# Altium project codenic-clock.PrjPcb
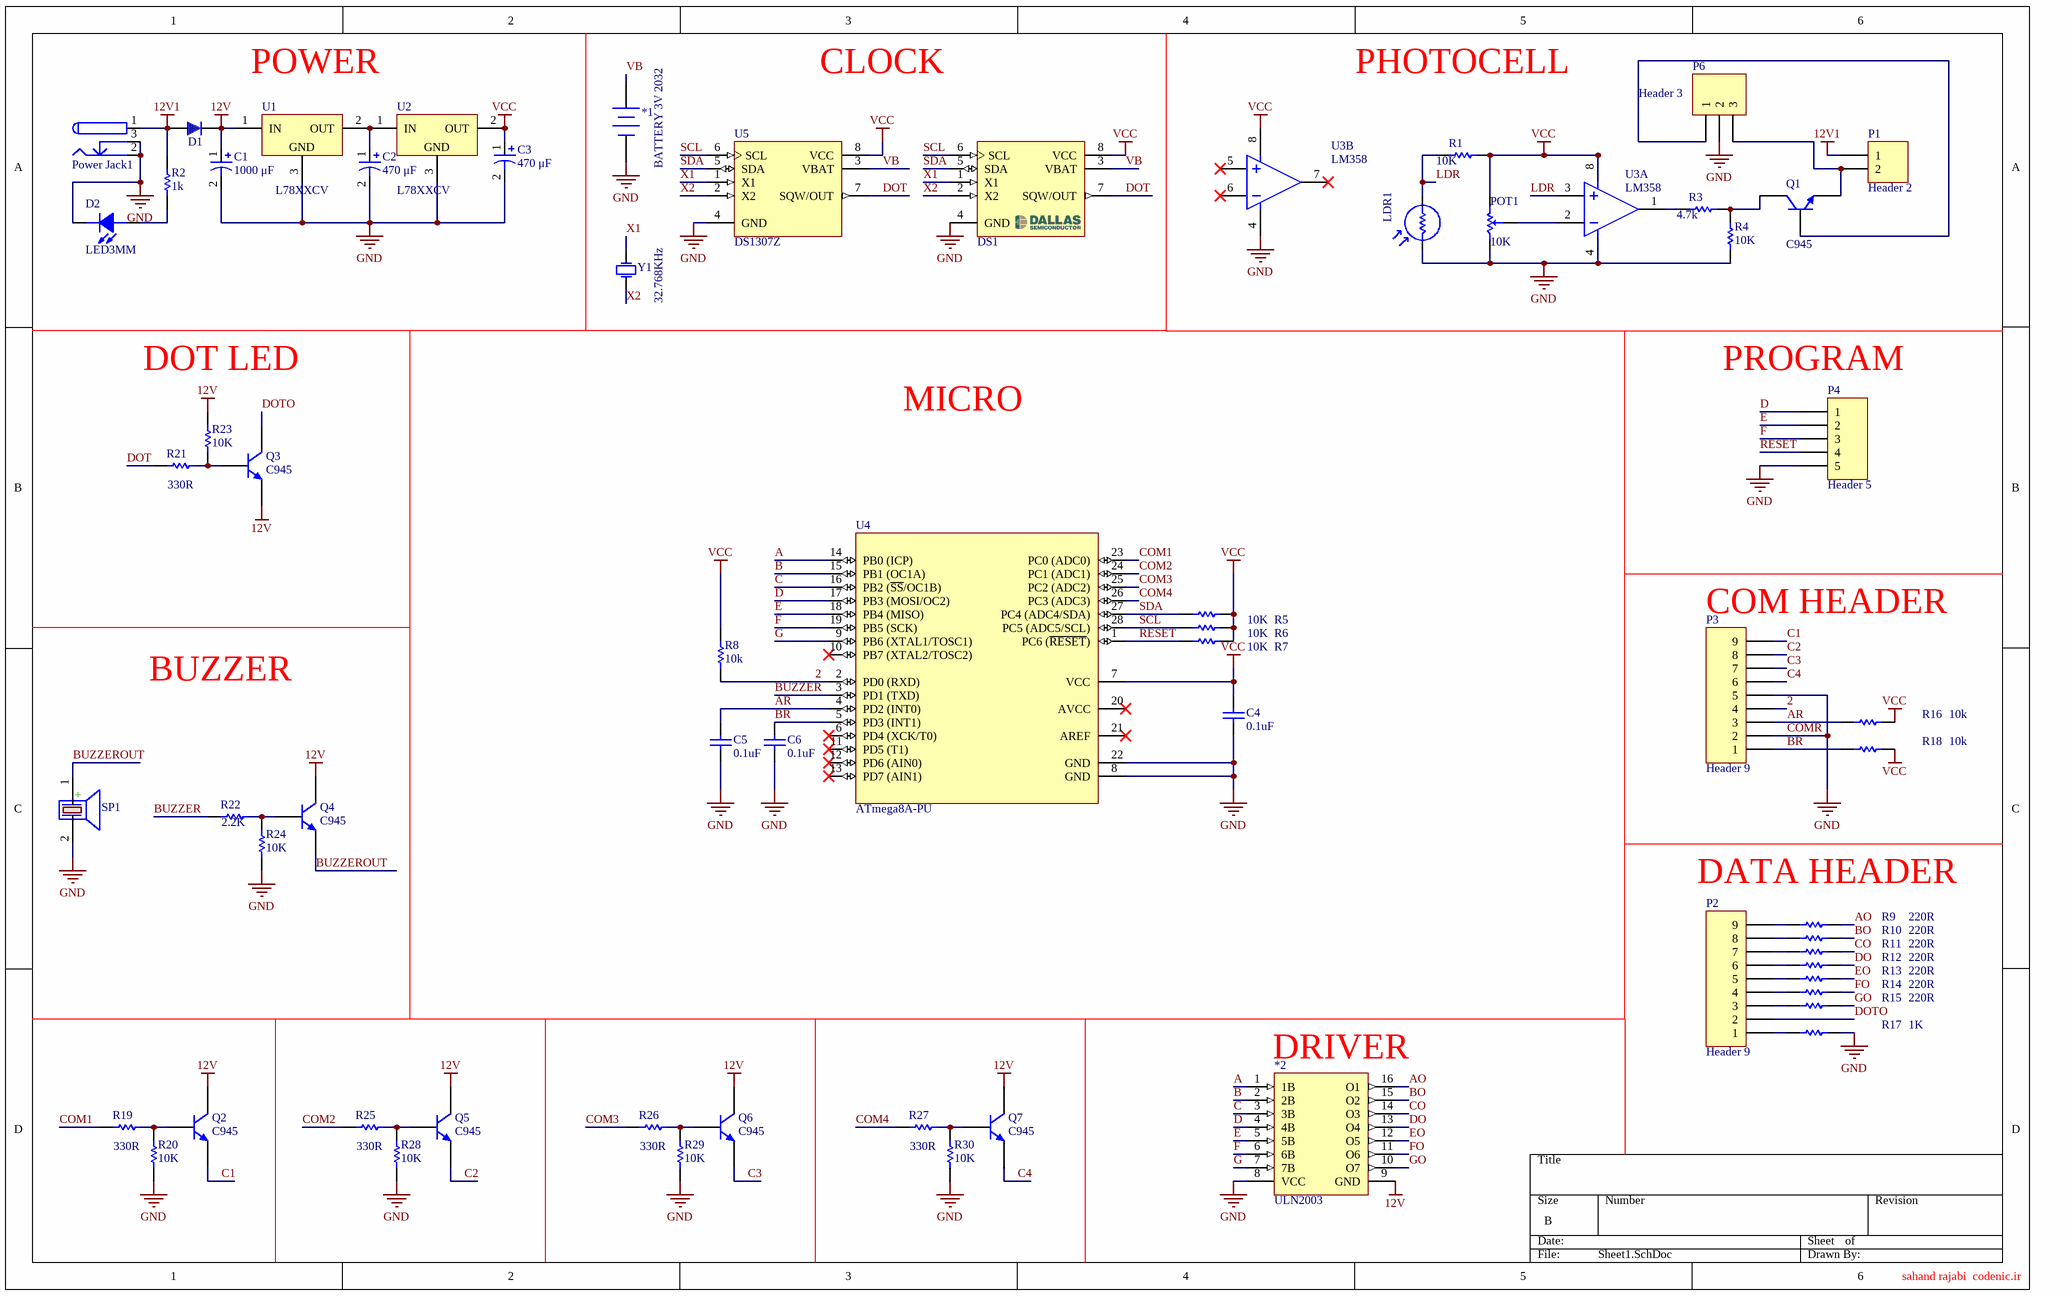
[diagram p0: Sheet1.SchDoc]
1 sheet, 63 parts. Net scope: global (net labels, ports and power ports of the same name join across sheets).
Board files: segment.PcbDoc, main.PcbDoc

## Sheet Sheet1.SchDoc
size B

### Parts
*1  BATTERY 3V 2032  [batt]
*2  ULN2003  [ULN2003]
C1  1000 μF  [WCAP-PTHT 8x11.5x3.5x0.6]
C2  470 μF  [WCAP-PTHT 8x8x3.5x0.6]
C3  470 μF  [WCAP-PTHT 8x8x3.5x0.6]
C4  0.1uF  [CAPC4817X12N]
C5  0.1uF  [CAPC4817X12N]
C6  0.1uF  [CAPC4817X12N]
D1  1n4007  [DIOM4629X24N]  (value not drawn)
D2  LED3MM  [LED3mm_GRN]
DS1  DS1307  [DIP_8]  (value not drawn)
LDR1  PhotoCell  [PhotoCell]  (value not drawn)
P1  Header 2  [HDR1X2]
P2  Header 9  [HDR1X9]
P3  Header 9  [HDR1X9]
P4  Header 5  [HDR1X5]
P6  Header 3  [HDR1X3]
POT1  10K  [POT 4]
Power_Jack1  Power Jack.  [Power Jack.]  (value not drawn)
Q1  C945  [c945]
Q2  C945  [C945]
Q3  C945  [C945]
Q4  C945  [C945]
Q5  C945  [C945]
Q6  C945  [C945]
Q7  C945  [C945]
R1  value 10K  [Resistor_SMD_1206]  (hidden comment: Resistor 0.25w)
R2  value 1k  [Resistor_SMD_1206]  (hidden comment: Resistor 0.25w)
R3  value 4.7k  [Resistor_SMD_1206]  (hidden comment: Resistor 0.25w)
R4  value 10K  [Resistor_SMD_1206]  (hidden comment: Resistor 0.25w)
R5  value 10K  [Resistor_SMD_1206]  (hidden comment: Resistor 0.25w)
R6  value 10K  [Resistor_SMD_1206]  (hidden comment: Resistor 0.25w)
R7  value 10K  [Resistor_SMD_1206]  (hidden comment: Resistor 0.25w)
R8  value 10k  [Resistor_SMD_1206]  (hidden comment: Resistor 0.25w)
R9  value 220R  [Resistor_SMD_1206]  (hidden comment: Resistor 0.25w)
R10  value 220R  [Resistor_SMD_1206]  (hidden comment: Resistor 0.25w)
R11  value 220R  [Resistor_SMD_1206]  (hidden comment: Resistor 0.25w)
R12  value 220R  [Resistor_SMD_1206]  (hidden comment: Resistor 0.25w)
R13  value 220R  [Resistor_SMD_1206]  (hidden comment: Resistor 0.25w)
R14  value 220R  [Resistor_SMD_1206]  (hidden comment: Resistor 0.25w)
R15  value 220R  [Resistor_SMD_1206]  (hidden comment: Resistor 0.25w)
R16  value 10k  [Resistor_SMD_1206]  (hidden comment: Resistor 0.25w)
R17  value 1K  [Resistor_SMD_1206]  (hidden comment: Resistor 0.25w)
R18  value 10k  [Resistor_SMD_1206]  (hidden comment: Resistor 0.25w)
R19  330R  [RESC3413X04N]
R20  10K  [RESC3413X04N]
R21  330R  [RESC3413X04N]
R22  2.2K  [RESC3413X04N]
R23  10K  [RESC3413X04N]
R24  10K  [RESC3413X04N]
R25  330R  [RESC3413X04N]
R26  330R  [RESC3413X04N]
R27  330R  [RESC3413X04N]
R28  10K  [RESC3413X04N]
R29  10K  [RESC3413X04N]
R30  10K  [RESC3413X04N]
SP1  (no value)  [BUZZER 7.62mm DC]
U1  L78XXCV  [78XXCV - Right]
U2  L78XXCV  [78XXCV - Right]
U3  LM358  [DIP8E]  (parts A,B of 2)
U4  ATmega8A-PU  [28P3]
U5  DS1307Z  [SOIC8N_N]
Y1  32.768KHz  [XTAL RTC]

### Nets
12V: *2.9(GND) C1.1 D1.2 Q2.2(C) Q3.1(E) Q4.2(C) Q5.2(C) Q6.2(C) Q7.2(C) R23.1 U1.1(IN)
12V1: D1.1 P1.1 Power_Jack1.1 R2.2
COMR: *1.2(-) *2.8(VCC) C1.2 C2.2 C3.2 C4.1 C5.1 C6.1 D2.2(CATHODE) DS1.4(GND) LDR1.1 P3.2 P3.5 P4.5 P6.2 POT1.1(CCW) Power_Jack1.2 Power_Jack1.3 R4.1 R17.2 R20.1 R24.1 R28.1 R29.1 R30.1 SP1.2(-) U1.3(GND) U2.3(GND) U3.4 U4.8(GND) U4.22(GND) U5.4(GND)  [also labelled GND]
VCC: C3.1 C4.2 DS1.8(VCC) POT1.2(CW) R1.2 R5.2 R6.2 R7.2 R8.2 R16.2 R18.2 U2.2(OUT) U3.8 U4.7(VCC) U5.8(VCC)
2: P3.4 R8.1 U4.2(PD0_(RXD))
A: *2.1(1B) U4.14(PB0_(ICP))
AO: *2.16(O1) R9.2
AR: C5.2 P3.3 R16.1 U4.4(PD2_(INT0))
B: *2.2(2B) U4.15(PB1_(OC1A))
BO: *2.15(O2) R10.2
BR: C6.2 P3.1 R18.1 U4.5(PD3_(INT1))
BUZZER: R22.1 U4.3(PD1_(TXD))
BUZZEROUT: Q4.1(E) SP1.1(+)
C: *2.3(3B) U4.16(PB2_(~{SS}/OC1B))
C1: P3.9 Q2.1(E)
C2: P3.8 Q5.1(E)
C3: P3.7 Q6.1(E)
C4: P3.6 Q7.1(E)
CO: *2.14(O3) R11.2
COM1: R19.1 U4.23(PC0_(ADC0))
COM2: R25.1 U4.24(PC1_(ADC1))
COM3: R26.1 U4.25(PC2_(ADC2))
COM4: R27.1 U4.26(PC3_(ADC3))
D: *2.4(4B) P4.1 U4.17(PB3_(MOSI/OC2))
DO: *2.13(O4) R12.2
DOT: DS1.7(SQW/OUT) R21.1 U5.7(SQW/OUT)
DOTO: P2.2 Q3.2(C)
E: *2.5(5B) P4.2 U4.18(PB4_(MISO))
EO: *2.12(O5) R13.2
F: *2.6(6B) P4.3 U4.19(PB5_(SCK))
FO: *2.11(O6) R14.2
G: *2.7(7B) U4.9(PB6_(XTAL1/TOSC1))
GO: *2.10(O7) R15.2
LDR: LDR1.2 R1.1 U3.3
RESET: P4.4 R7.1 U4.1(PC6_(~{RESET}))
SCL: DS1.6(SCL) R6.1 U4.28(PC5_(ADC5/SCL)) U5.6(SCL)
SDA: DS1.5(SDA) R5.1 U4.27(PC4_(ADC4/SDA)) U5.5(SDA)
VB: *1.1(+) DS1.3(VBAT) U5.3(VBAT)
X1: DS1.1(X1) U5.1(X1) Y1.2(OSC2)
X2: DS1.2(X2) U5.2(X2) Y1.1(OSC1)
NetC2_1: C2.1 U1.2(OUT) U2.1(IN)
NetD2_1: D2.1(ANODE) R2.1
NetP1_2: P1.2 P6.3 Q1.2(E)
NetP2_1: P2.1 R17.1
NetP2_3: P2.3 R15.1
NetP2_4: P2.4 R14.1
NetP2_5: P2.5 R13.1
NetP2_6: P2.6 R12.1
NetP2_7: P2.7 R11.1
NetP2_8: P2.8 R10.1
NetP2_9: P2.9 R9.1
NetP6_1: P6.1 Q1.1(B)
NetPOT1_3: POT1.3(SetPoint) U3.2
NetQ1_3: Q1.3(C) R3.2 R4.2
NetQ2_3: Q2.3(B) R19.2 R20.2
NetQ3_3: Q3.3(B) R21.2 R23.2
NetQ4_3: Q4.3(B) R22.2 R24.2
NetQ5_3: Q5.3(B) R25.2 R28.2
NetQ6_3: Q6.3(B) R26.2 R29.2
NetQ7_3: Q7.3(B) R27.2 R30.2
NetR3_1: R3.1 U3.1

Not connected (* = marked no-connect by the designer): U3 5* 6* 7*; U4 6(PD4_(XCK/T0))* 10(PB7_(XTAL2/TOSC2))* 11(PD5_(T1))* 12(PD6_(AIN0))* 13(PD7_(AIN1))* 20(AVCC)* 21(AREF)*

### Notes on the sheet
- POWER
- CLOCK
- PHOTOCELL
- DOT LED
- (near P4) PROGRAM
- MICRO
- (near P3) COM HEADER
- BUZZER
- DATA HEADER
- (near *2) DRIVER
- sahand rajabi  codenic.ir

### Library data of the parts
C1 = WCAP-PTHT 8x11.5x3.5x0.6 870135174006: WCAP-PTHT Aluminum Polymer Capacitors , 1000 μF; + / - 20%; 6,3 V , 8 x 11,5; Manufacturer: Wurth Elektronik; E-mail: libraries@we-online.com; Characteristics: Aluminum Polymer Capacitors;Recommended soldering: Wave;Operating temperature: –55 °C to +125 °C;+125 °C product series;Low ESR at high frequency range;Long life: 2000 h @ +125 °C; ComponentLink1Description: Manufacturer; ComponentLink1URL: http://www.we-online.com; ComponentLink2Description: Datasheet; ComponentLink2URL: http://katalog.we-online.de/pbs/datasheet/870135174006.pdf; Created by: Karrer Zheng; Created Date: 5/13/2015; Capacitance: 1000 μF; Application: Low voltage port filtering, appplid to high-end switching power supply, PC(desktop,laptop ),industrial computer, VGA card, server power, charger, TV, digital set-top box,DC-DC power module, game machine etc which consume large current with high speed circuit.; partNo: 870135174006
C2 C3 = WCAP-PTHT 8x8x3.5x0.6 870135174002: WCAP-PTHT Aluminum Polymer Capacitors , 470 μF; + / - 20%; 6,3 V , 8 x 8; Manufacturer: Wurth Elektronik; E-mail: libraries@we-online.com; Characteristics: Aluminum Polymer Capacitors;Recommended soldering: Wave;Operating temperature: –55 °C to +125 °C;+125 °C product series;Low ESR at high frequency range;Long life: 2000 h @ +125 °C; ComponentLink1Description: Manufacturer; ComponentLink1URL: http://www.we-online.com; ComponentLink2Description: Datasheet; ComponentLink2URL: http://katalog.we-online.de/pbs/datasheet/870135174002.pdf; Created by: Karrer Zheng; Created Date: 5/13/2015; Capacitance: 470 μF; Application: Low voltage port filtering, appplid to high-end switching power supply, PC(desktop,laptop ),industrial computer, VGA card, server power, charger, TV, digital set-top box,DC-DC power module, game machine etc which consume large current with high speed circuit.; partNo: 870135174002
C4-C6 = CAP SMD 1206: CAP 1206; Designer: Abbas Basereh; Desc.: CAP SMD 1206; Data: 16-12-2016
D1 = 1n4007 SMD M7: Standard Rectifiers; Part. No: M7; Manufacturer: DC COMPONENTS; Designer: Abbas Basereh; Link: http://www.tme.eu/en/details/m7/smd-universal-diodes/dc-components/; Link: https://www.aliexpress.com/item/Smd-tube-1n4007-m7-SMA/1213719741.html?spm=2114.01010208.3.1.ZyZ7bC&ws_ab_test=searchweb0_0,searchweb201602_4_10065_10068_10084_10083_10080_10082_10081_10060_10061_10062_10056_10055_10054_10059_10099_10078_10079_427_10073_10103_10102_10096_10052_10050_10051,searchweb201603_4&btsid=db2be5ca-e560-400a-b91c-484ab5ee228b; Data: 16-12-2016
D2 = LED 3MM: Light Emitting Diode; Designer: Ali Hafizi
DS1 = DS1307.: LatestRevisionDate: 17-Jul-2002; LatestRevisionNote: Re-released for DXP Platform.; Publisher: Altium Limited
LDR1 = LDR: Photo Cell- Variable Resistor With Light; Company: IPA CO.; Designer: Saeid Jorablo; Last Update Time: 2008/07/17
P1 = Header 2: Header, 2-Pin; LatestRevisionDate: 17-Jul-2002; LatestRevisionNote: Re-released for DXP Platform.; Publisher: Altium Limited
P2 P3 = Header 9: Header, 9-Pin; LatestRevisionDate: 17-Jul-2002; LatestRevisionNote: Re-released for DXP Platform.; Publisher: Altium Limited
P4 = Header 5: Header, 5-Pin; LatestRevisionDate: 17-Jul-2002; LatestRevisionNote: Re-released for DXP Platform.; Publisher: Altium Limited
P6 = Header 3: Header, 3-Pin; LatestRevisionDate: 17-Jul-2002; LatestRevisionNote: Re-released for DXP Platform.; Publisher: Altium Limited
POT1 = POT: Variable Resistor; Value: 10K
Q1 = C945: NPN Silicon Epitaxial Planar Transistor; Published: 2017-2-8; LatestRevisionDate: 2017; LatestRevisionNote: IPC-7351 Footprint Added.; DatasheetVersion: 2017; PackageVersion: 2017-2-8; PackageReference: SOT23; Publisher: Abbas Basereh; PackageDescription: 3-Pin SOT-23 Package 0.95 mm Pitch, 2.3 mm Lead Span; ComponentLink1Description: Manufacturer Link; ComponentLink1URL: http://www.taitroncomponents.com/; ComponentLink2Description: Datasheet; ComponentLink2URL: http://www.taitroncomponents.com/
Q2-Q7 = C945: NPN Transistor; Designer: Saeid Jorablo; Company: IPA CO; Last Update Time: 2008/08/04; Value: C945
R1-R18 = Resistor: LatestRevisionDate: 17-Jul-2002; LatestRevisionNote: Re-released for DXP Platform.; Publisher: Altium Limited
R19-R30 = RES 0805 0.125W: RES 0805; Designer: Abbas Basereh; Desc.: RES SMD 0805; Data: 16-12-2016
SP1 = PIEZO BUZZER: PIEZO BUZZER ACTIVE; Designer: Abbas Basereh; Comment_1: SPEAKER AND BEEP; Design Date: 1395/11/14; ComponentLink2Description: Reference; PackageDescription: THD; Publisher: Abbas Basereh; Mounting Technology: THD; Pin Count: 2; Status: Unreleased
U1 U2 = L78XXCV: Fixed Voltage Regulator; Designer: Saeid Jorablo; Company: ControTec; Adding Date: 1387/01/06; Voltage: *
U3 = 1458
U4 = ATmega8A-PU: 8-bit AVR Microcontroller, 8KB Flash, 512 Bytes EEPROM, 1KB SRAM, 28-pin PDIP, Industrial Grade (-40°C to 85°C); Published: 2017-1-5; DatasheetVersion: 2017-1-5; PackageVersion: 2017-1-5; PackageReference: 28P3; Publisher: Abbas Basereh; PackageDescription: 28-lead (0.300"/7.62mm Wide) Plastic Dual Inline Package (PDIP); Supplier 1: Digi-Key; Supplier Part Number 1: ATMEGA8A-PU-ND; Supplier 2: Farnell; Supplier Part Number 2: 1748534; Supplier 3: Mouser; Supplier Part Number 3: 556-ATMEGA8A-PU; ComponentLink1Description: Manufacturer Link; ComponentLink1URL: http://www.atmel.com/products/avr/default.asp?; ComponentLink2Description: ATmega8A Datasheet; ComponentLink2URL: http://www.atmel.com/dyn/resources/prod_documents/doc8159.pdf; ComponentLink3Description: ATmega8A Summary; ComponentLink3URL: http://www.atmel.com/dyn/resources/prod_documents/8159S.pdf; ComponentLink4Description: Atmel.com Home; ComponentLink4URL: http://www.atmel.com
U5 = DS1307Z: 64 X 8 Serial Real-Time Clock; Published: 13-Oct-2000; LatestRevisionDate: 13-Apr-2006; LatestRevisionNote: IPC-7351 Footprint Added.; DatasheetVersion: 10-Aug-1999; PackageVersion: 1999; PackageReference: SOIC8N; Publisher: Altium Limited; PackageDescription: 8-Pin Small Outline Integrated Circuit 1.27 mm Pitch; Code_IPC: SOIC127P600-8; ComponentLink1Description: Manufacturer Link; ComponentLink1URL: http://www.maxim-ic.com/; ComponentLink2Description: Datasheet; ComponentLink2URL: http://pdfserv.maxim-ic.com/en/ds/DS1307.pdf; ComponentLink3Description: Discontinuation Notice; ComponentLink3URL: http://www.maxim-ic.com/qa/pdfs/non-obsolescence-letter.pdf
Y1 = XTAL: XTAL Crystal; Designer: ABBAS BASEREH; Value: 12 MHz; Design Date: 2017-1-3; ComponentLink1Description: Datasheet; ComponentLink2Description: Reference; Mounting Technology: Surface Mount\Through-Hole; Status: Unreleased